# Altium schematic sheet motorEncoder.SchDoc
size A
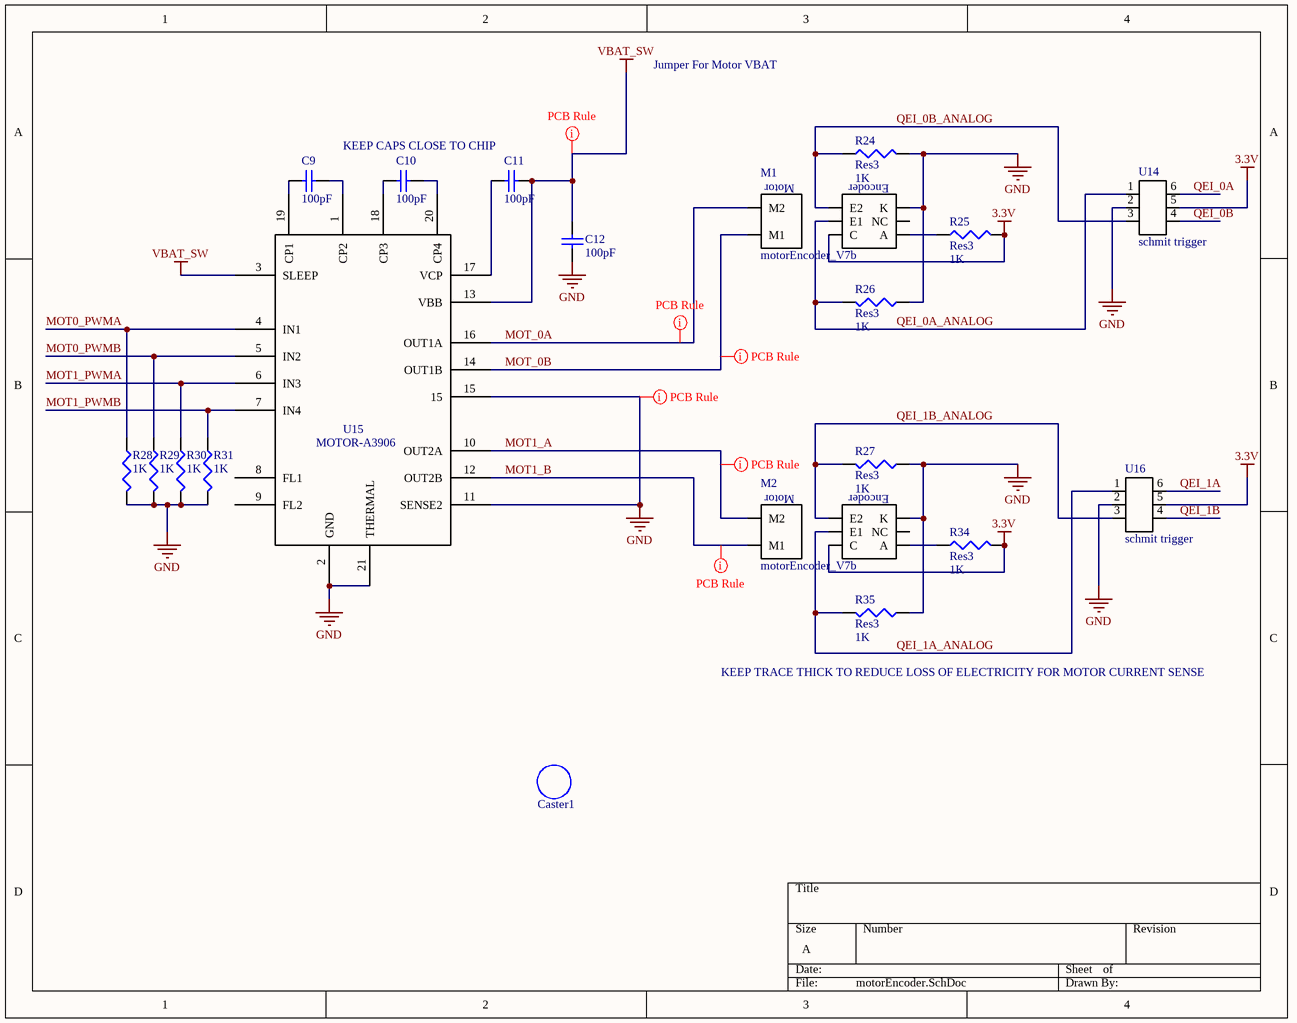
[diagram p0: motorEncoder.SchDoc]

## Parts
C9  value 100pF  [CAPC1005L]  (hidden comment: Cap Semi)
C10  value 100pF  [CAPC1005L]  (hidden comment: Cap Semi)
C11  value 100pF  [CAPC1005L]  (hidden comment: Cap Semi)
C12  value 100pF  [CAPC1005L]  (hidden comment: Cap Semi)
Caster1  non connect  [3/4"CASTER2]  (value not drawn)
M1  motorEncoder_V7b  [motorEncoder_V7b]
M2  motorEncoder_V7b  [motorEncoder_V7b]
R24  Res3  value 1K  [RESC1608L]
R25  Res3  value 1K  [RESC1608L]
R26  Res3  value 1K  [RESC1608L]
R27  Res3  value 1K  [RESC1608L]
R28  value 1K  [RESC1608L]  (hidden comment: Res3)
R29  value 1K  [RESC1608L]  (hidden comment: Res3)
R30  value 1K  [RESC1608L]  (hidden comment: Res3)
R31  value 1K  [RESC1608L]  (hidden comment: Res3)
R34  Res3  value 1K  [RESC1608L]
R35  Res3  value 1K  [RESC1608L]
U14  schmit trigger  [DCK(R-PDSO-C6)]
U15  MOTOR-A3906  [QFN-20]
U16  schmit trigger  [DCK(R-PDSO-C6)]

## Nets
3.3V: M1.C M2.C R25.2 R34.2 U14.5 U16.5
GND: C12.1 M1.K M2.K R24.2 R26.1 R27.1 R28.2 R29.2 R30.2 R31.2 R35.1 U14.2 U15.2(GND) U15.11(SENSE2) U15.15 U15.21(THERMAL) U16.2
VBAT_SW: C11.1 C12.2 U15.3(SLEEP) U15.13(VBB)
MOT0_PWMA: R28.1 U15.4(IN1)
MOT0_PWMB: R29.1 U15.5(IN2)
MOT1_A: M2.M2 U15.10(OUT2A)
MOT1_B: M2.M1 U15.12(OUT2B)
MOT1_PWMA: R30.1 U15.6(IN3)
MOT1_PWMB: R31.1 U15.7(IN4)
MOT_0A: M1.M2 U15.16(OUT1A)
MOT_0B: M1.M1 U15.14(OUT1B)
QEI_0A: U14.6
QEI_0A_ANALOG: M1.E1 R26.2 U14.1
QEI_0B: U14.4
QEI_0B_ANALOG: M1.E2 R24.1 U14.3
QEI_1A: U16.6
QEI_1A_ANALOG: M2.E1 R35.2 U16.1
QEI_1B: U16.4
QEI_1B_ANALOG: M2.E2 R27.2 U16.3
NetC9_1: C9.1 U15.19(CP1)
NetC9_2: C9.2 U15.1(CP2)
NetC10_1: C10.1 U15.18(CP3)
NetC10_2: C10.2 U15.20(CP4)
NetC11_2: C11.2 U15.17(VCP)
NetM1_A: M1.A R25.1
NetM2_A: M2.A R34.1

Not connected (* = marked no-connect by the designer): M1 NC; M2 NC; U15 8(FL1) 9(FL2)

## Layout directives
rule Width Constraint [Pref Width = 20mil    Min Width = 10mil    Max Width = 25mil]: GND, MOT1_A, MOT1_B, MOT_0A, MOT_0B, VBAT_SW

## Notes on the sheet
- Jumper For Motor VBAT
- KEEP CAPS CLOSE TO CHIP
- KEEP TRACE THICK TO REDUCE LOSS OF ELECTRICITY FOR MOTOR CURRENT SENSE
- (in symbol motorEncoder_V7b) Motor; Encoder

## Library data of the parts
C9-C12 = Cap Semi: Capacitor (Semiconductor SIM Model); Published: 8-Jun-2000; LatestRevisionDate: 29-May-2009; LatestRevisionNote: IPC-7351 Footprint Added.; PackageReference: C1206; Publisher: Altium Limited; PackageDescription: Chip Capacitor
Caster1 = Caster 3/4in: This is just a space saver to get the caster onto the pcb
R24-R31 R34 R35 = Res3: Resistor; Published: 8-Jun-2000; LatestRevisionDate: 29-May-2009; LatestRevisionNote: IPC-7351 Footprint Added.; PackageReference: J1-0603; Publisher: Altium Limited; PackageDescription: Chip Resistor